# EAGLE design Arduino-DUE-V03A (EAGLE 8.5.2)
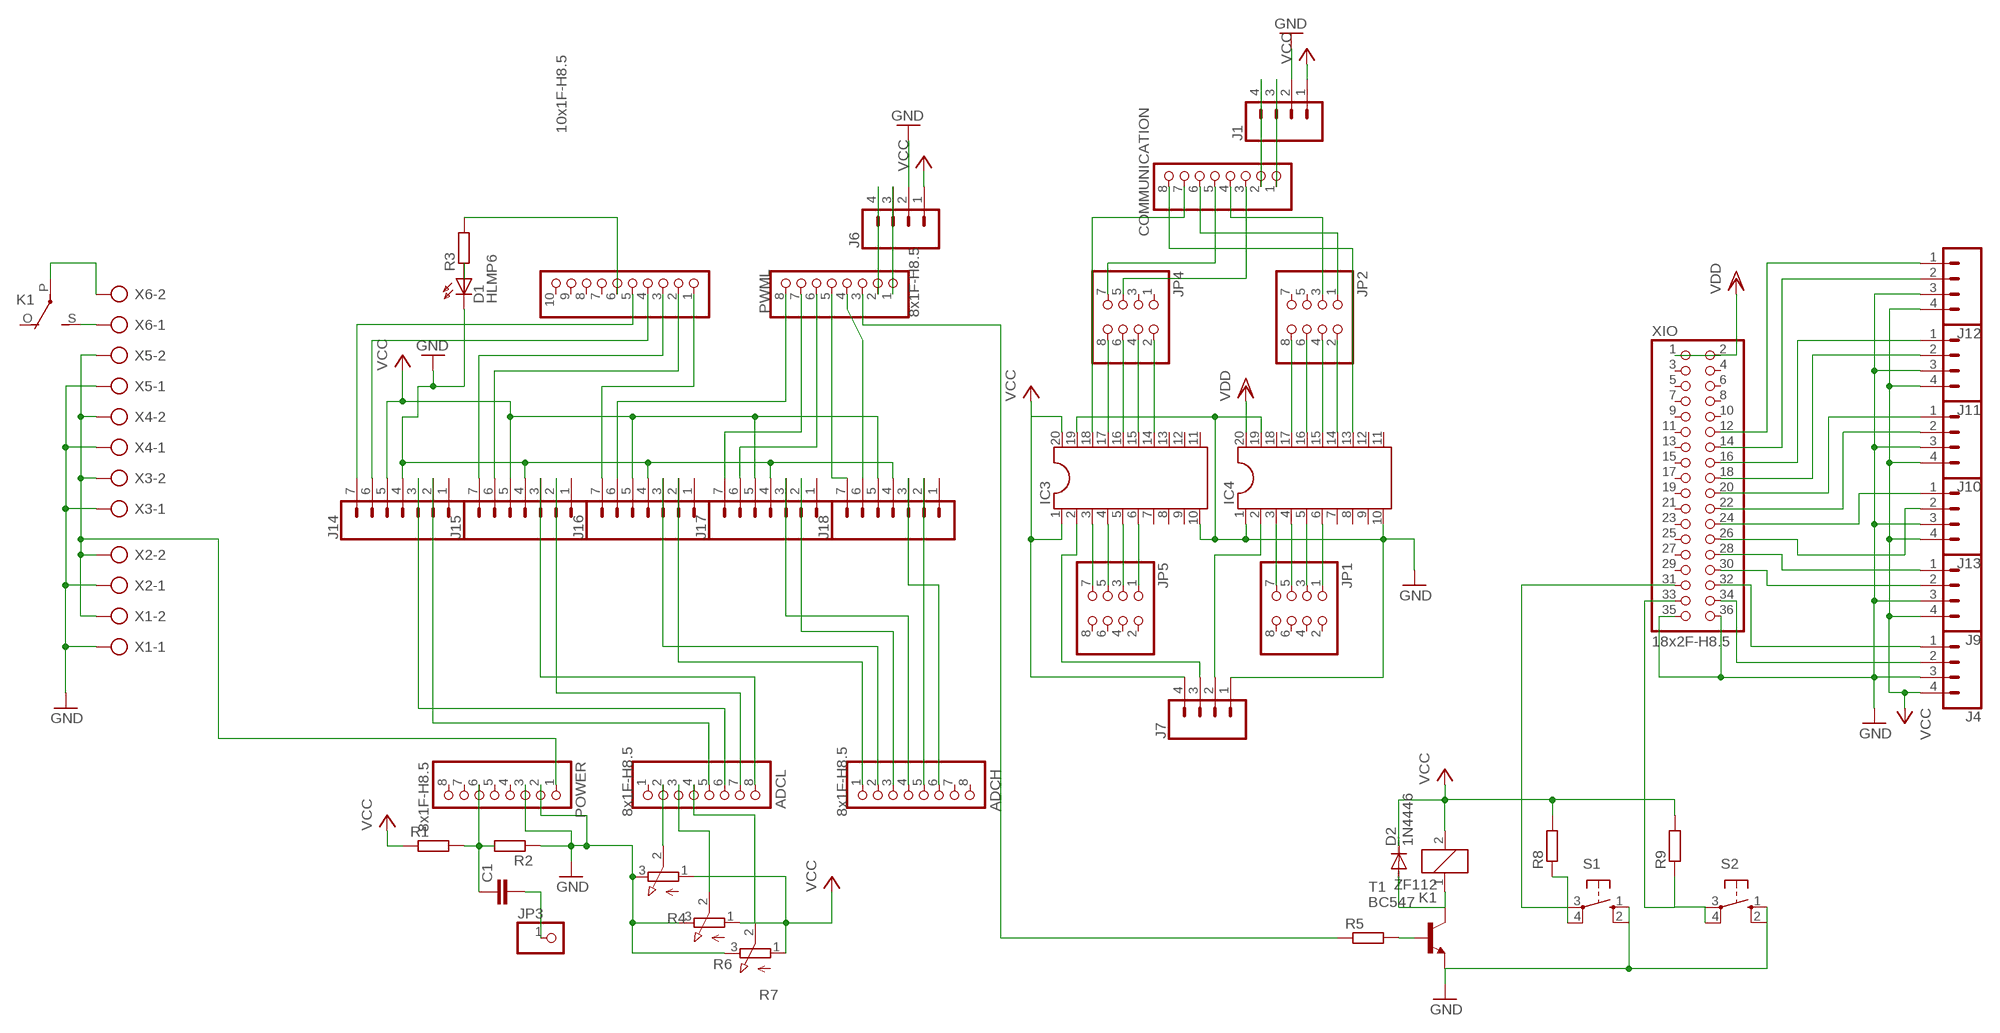
[diagram p0: schematic, sheet 1]

## Parts
ADCH  8x1F-H8.5  PINHD-1X8  [1X08]
ADCL  8x1F-H8.5  PINHD-1X8  [1X08]
C1  C-EU025-025X050  [C025-025X050]
COMMUNICATION  8x1F-H8.5  PINHD-1X8  [1X08]
D1  HLMP6  [HLMP6]
D2  1N4446  [DO35-10]
IC3  DIL20S  [SOCKET-20]
IC4  DIL20S  [SOCKET-20]
J1  CONN_04LONGPADS  [1X04_LONGPADS]
J4  CONN_04LONGPADS  [1X04_LONGPADS]
J6  CONN_04LONGPADS  [1X04_LONGPADS]
J7  CONN_04LONGPADS  [1X04_LONGPADS]
J9  CONN_04LONGPADS  [1X04_LONGPADS]
J10  CONN_04LONGPADS  [1X04_LONGPADS]
J11  CONN_04LONGPADS  [1X04_LONGPADS]
J12  CONN_04LONGPADS  [1X04_LONGPADS]
J13  CONN_04LONGPADS  [1X04_LONGPADS]
J14  CONN_07LONGPADS  [1X07_LONGPADS]
J15  CONN_07LONGPADS  [1X07_LONGPADS]
J16  CONN_07LONGPADS  [1X07_LONGPADS]
J17  CONN_07LONGPADS  [1X07_LONGPADS]
J18  CONN_07LONGPADS  [1X07_LONGPADS]
JP1  PINHD-2X4  [2X04]
JP2  PINHD-2X4  [2X04]
JP3  PINHD-1X1  [1X01]
JP4  PINHD-2X4  [2X04]
JP5  PINHD-2X4  [2X04]
K1  ZF112  [ZF112]
POWER  8x1F-H8.5  PINHD-1X8  [1X08]
PWMH  10x1F-H8.5  PINHD-1X10  [1X10]
PWML  8x1F-H8.5  PINHD-1X8  [1X08]
R1  R-EU_0204/7  [0204/7]
R2  R-EU_0204/7  [0204/7]
R3  R-EU_0204/7  [0204/7]
R4  3RP/1610N  [3RP/1610N]
R5  R-EU_0204/7  [0204/7]
R6  3RP/1610N  [3RP/1610N]
R7  3RP/1610N  [3RP/1610N]
R8  R-EU_0204/7  [0204/7]
R9  R-EU_0204/7  [0204/7]
S1  10-XX  [B3F-10XX]
S2  10-XX  [B3F-10XX]
T1  BC547  [TO92]
X1  AK500/2  [AK500/2]
X2  AK500/2  [AK500/2]
X3  AK500/2  [AK500/2]
X4  AK500/2  [AK500/2]
X5  AK500/2  [AK500/2]
X6  AK500/2  [AK500/2]
XIO  18x2F-H8.5  PINHD-2X18  [2X18]

## Nets
GND: D1.K IC3.10 IC3.19 IC4.1 IC4.10 IC4.19 J1.2 J4.3 J6.2 J7.1 J9.3 J10.3 J11.3 J12.3 J13.1 J13.3 J14.4 J15.4 J16.4 J17.4 J18.4 POWER.2 POWER.3 R2.1 R4.3(E) R6.3(E) R7.3(E) S1.1(S) S1.2(S1) S2.1(S) S2.2(S1) T1.1(E) X1.1 X2.1 X3.1 X4.1 X5.1 XIO.24 XIO.35 XIO.36
N$1: J14.6 PWMH.4
N$3: K1.S(2:S) X6.1
N$4: K1.P(2:P) X6.2
N$6: J4.2 XIO.34
N$7: J15.6 PWMH.2
N$8: J4.1 XIO.32
N$9: COMMUNICATION.3 JP4.5
N$10: J9.2 XIO.30
N$11: J13.2 XIO.26
N$12: POWER.1 X1.2 X2.2 X3.2 X4.2 X5.2
N$13: J12.2 XIO.14
N$14: J10.2 XIO.22
N$15: J10.1 XIO.20
N$16: J11.2 XIO.18
N$17: J11.1 XIO.16
N$18: J12.1 XIO.12
N$19: R5.2 T1.2(B)
N$20: C1.2 JP3.1
N$21: J16.7 PWMH.1
N$22: J14.7 PWMH.5
N$23: J15.7 PWMH.3
N$24: J17.7 PWML.7
N$25: J16.6 PWML.8
N$26: J17.6 PWML.6
N$27: J18.6 PWML.4
N$28: ADCL.6 J14.3
N$29: ADCL.5 J14.2
N$30: ADCH.6 J18.3
N$31: ADCH.5 J18.2
N$32: ADCH.4 J17.3
N$33: D1.A R3.1
N$34: ADCH.3 J17.2
N$35: ADCH.2 J16.3
N$36: ADCH.1 J16.2
N$37: ADCL.8 J15.3
N$38: PWMH.6 R3.2
N$39: C1.1 POWER.6 R1.2 R2.2
N$40: ADCL.7 J15.2
N$41: J18.7 PWML.5
N$42: COMMUNICATION.1 J1.3
N$43: IC4.17 JP2.8
N$44: IC4.16 JP2.6
N$45: IC4.15 JP2.4
N$46: IC4.14 JP2.2
N$47: IC3.6 JP5.1
N$48: IC3.5 JP5.3
N$49: IC3.4 JP5.5
N$50: IC3.3 JP5.7
N$51: IC3.17 JP4.8
N$52: IC3.16 JP4.6
N$53: IC3.15 JP4.4
N$54: IC3.14 JP4.2
N$55: IC4.3 JP1.7
N$56: IC4.4 JP1.5
N$57: IC4.5 JP1.3
N$58: IC4.6 JP1.1
N$59: COMMUNICATION.7 IC3.18
N$60: J6.4 PWML.2
N$61: J6.3 PWML.1
N$62: COMMUNICATION.6 JP2.1
N$63: COMMUNICATION.2 J1.4
N$64: COMMUNICATION.4 JP2.3
N$65: COMMUNICATION.5 JP4.7
N$66: IC3.2 J7.3
N$67: IC4.2 J7.2
N$68: D2.A K1.1 T1.3(C)
N$69: R8.1 S1.3(P) S1.4(P1) XIO.31
N$70: ADCL.2 R4.2(S)
N$71: ADCL.4 R7.2(S)
N$72: ADCL.3 R6.2(S)
N$73: PWML.3 R5.1
N$74: R9.1 S2.3(P) S2.4(P1) XIO.33
N$75: J9.1 XIO.28
N$76: COMMUNICATION.8 IC4.13
VCC: D2.C IC3.1 IC3.20 J1.1 J4.4 J6.1 J7.4 J9.4 J10.4 J11.4 J12.4 J13.4 J14.5 J15.5 J16.5 J17.5 J18.5 K1.2 R1.1 R4.1(A) R6.1(A) R7.1(A) R8.2 R9.2
VDD: IC4.20 XIO.1 XIO.2
Unconnected: ADCH.7 ADCH.8 ADCL.1 IC3.7 IC3.8 IC3.9 IC3.11 IC3.12 IC3.13 IC4.7 IC4.8 IC4.9 IC4.11 IC4.12 IC4.18 J14.1 J15.1 J16.1 J17.1 J18.1 JP1.2 JP1.4 JP1.6 JP1.8 JP2.5 JP2.7 JP4.1 JP4.3 JP5.2 JP5.4 JP5.6 JP5.8 K1.O(2:O) POWER.4 POWER.5 POWER.7 POWER.8 PWMH.7 PWMH.8 PWMH.9 PWMH.10 XIO.3 XIO.4 XIO.5 XIO.6 XIO.7 XIO.8 XIO.9 XIO.10 XIO.11 XIO.13 XIO.15 XIO.17 XIO.19 XIO.21 XIO.23 XIO.25 XIO.27 XIO.29

## Library data of the parts
ADCH ADCL COMMUNICATION POWER PWML = SmartPrj:PINHD-1X8: PIN HEADER
C1 = rcl:C-EU: CAPACITOR, European symbol
D1 = display-hp:HLMP6: LED 2mm horizontal; MF: AGILENT TECHNOLOGIES; MPN: HLMP-6500; OC_FARNELL: 1652490; OC_NEWARK: 40K0088
D2 = diode:1N4446: DIODE high speed (Philips)
IC3 IC4 = ic-package:DIL20: Dual In Line / Socket
J1 J4 J6 J7 J9-J13 = SparkFun-Connectors:CONN_04: Multi connection point. Often used as Generic Header-pin footprint for 0.1 inch spaced/style header connections On any of the 0.1 inch spaced packages, you can populate with these: Break Away Headers - Straight <https://www.sparkfun.com/products/116> (PRT-00116) Break Away Male Headers - Right Angle <https://www.sparkfun.com/products/553> (PRT-00553) Female Headers <https://www.sparkfun.com/products/115> (PRT-00115) Break Away Headers - Machine Pin <https://www.sparkfun.com/products/117> (PRT-00117) Break Away Female Headers - Swiss Machine Pin <https://www.sparkfun.com/products/743> (PRT-00743) For SCREWTERMINALS and SPRING TERMINALS visit here: Screw Terimnals on SparkFun.com <https://www.sparkfun.com/search/results?term=Screw+Terminals> (5mm/3.5mm/2.54mm spacing) This device is also useful as a general connection point to wire up your design to another part of your project. Our various solder wires solder well into these plated through hole pads. Hook-Up Wire - Assortment (Stranded, 22 AWG) <https://www.sparkfun.com/products/11375> (PRT-11375) Hook-Up Wire - Assortment (Solid Core, 22 AWG) <https://www.sparkfun.com/products/11367> (PRT-11367) View the entire wire category on our website here <https://www.sparkfun.com/categories/141> Special notes: Molex polarized connector foot print use with SKU : PRT-08231 with associated crimp pins and housings. 1MM SMD Version SKU: PRT-10208; PROD_ID: CONN-09696
J14-J18 = SparkFun-Connectors:CONN_07: Multi connection point. Often used as Generic Header-pin footprint for 0.1 inch spaced/style header connections On any of the 0.1 inch spaced packages, you can populate with these: Break Away Headers - Straight <https://www.sparkfun.com/products/116> (PRT-00116) Break Away Male Headers - Right Angle <https://www.sparkfun.com/products/553> (PRT-00553) Female Headers <https://www.sparkfun.com/products/115> (PRT-00115) Break Away Headers - Machine Pin <https://www.sparkfun.com/products/117> (PRT-00117) Break Away Female Headers - Swiss Machine Pin <https://www.sparkfun.com/products/743> (PRT-00743) For SCREWTERMINALS and SPRING TERMINALS visit here: Screw Terimnals on SparkFun.com <https://www.sparkfun.com/search/results?term=Screw+Terminals> (5mm/3.5mm/2.54mm spacing) This device is also useful as a general connection point to wire up your design to another part of your project. Our various solder wires solder well into these plated through hole pads. Hook-Up Wire - Assortment (Stranded, 22 AWG) <https://www.sparkfun.com/products/11375> (PRT-11375) Hook-Up Wire - Assortment (Solid Core, 22 AWG) <https://www.sparkfun.com/products/11367> (PRT-11367) View the entire wire category on our website here <https://www.sparkfun.com/categories/141> Special notes: Molex polarized connector foot print use with SKU : PRT-08231 with associated crimp pins and housings. 1MM SMD Version SKU: PRT-10208 NOTES ON THE VARIANTS LOCK and LOCK_LONGPADS... This footprint was designed to help hold the alignment of a through-hole component (i.e. 6-pin header) while soldering it into place. You may notice that each hole has been shifted either up or down by 0.005 of an inch from it's more standard position (which is a perfectly straight line). This slight alteration caused the pins (the squares in the middle) to touch the edges of the holes. Because they are alternating, it causes a "brace" to hold the component in place. 0.005 has proven to be the perfect amount of "off-center" position when using our standard breakaway headers. Although looks a little odd when you look at the bare footprint, once you have a header in there, the alteration is very hard to notice. Also,if you push a header all the way into place, it is covered up entirely on the bottom side.
JP1 JP2 JP4 JP5 = pinhead:PINHD-2X4: PIN HEADER
JP3 = pinhead:PINHD-1X1: PIN HEADER
K1 = relay:ZF112: RELAY 1 x switch; OC_FARNELL: unknown; OC_NEWARK: unknown
PWMH = SmartPrj:PINHD-1X10: PIN HEADER
R1-R3 R5 R8 R9 = rcl:R-EU_: RESISTOR, European symbol
R4 R6 R7 = pot:3RP/1610N: 16mm Potentiometer one level Source: http://www.alphapotentiometers.net/html/16mm_pot_2.html
S1 S2 = switch-omron:10-XX: OMRON SWITCH; MPN: B3F-1000; OC_FARNELL: 176432; OC_NEWARK: 36M3542
T1 = transistor:BC547: NPN TRANSISTOR
X1-X6 = con-ptr500:AK500/2: CONNECTOR; OC_FARNELL: unknown; OC_NEWARK: unknown
XIO = SmartPrj:PINHD-2X18: PIN HEADER

## Net classes
0 default: width 0.203 mm, drill 0.406 mm, clearance 0.203 mm
1 USB: width 0.203 mm, drill 0.406 mm, clearance 0.203 mm
2 gnd: width 0.203 mm, drill 0.406 mm, clearance 0.203 mm
3 usbvcc: width 0.203 mm, drill 0.406 mm, clearance 0.203 mm
4 USBpair: width 0.254 mm, drill 0.406 mm, clearance 0.61 mm

## Board
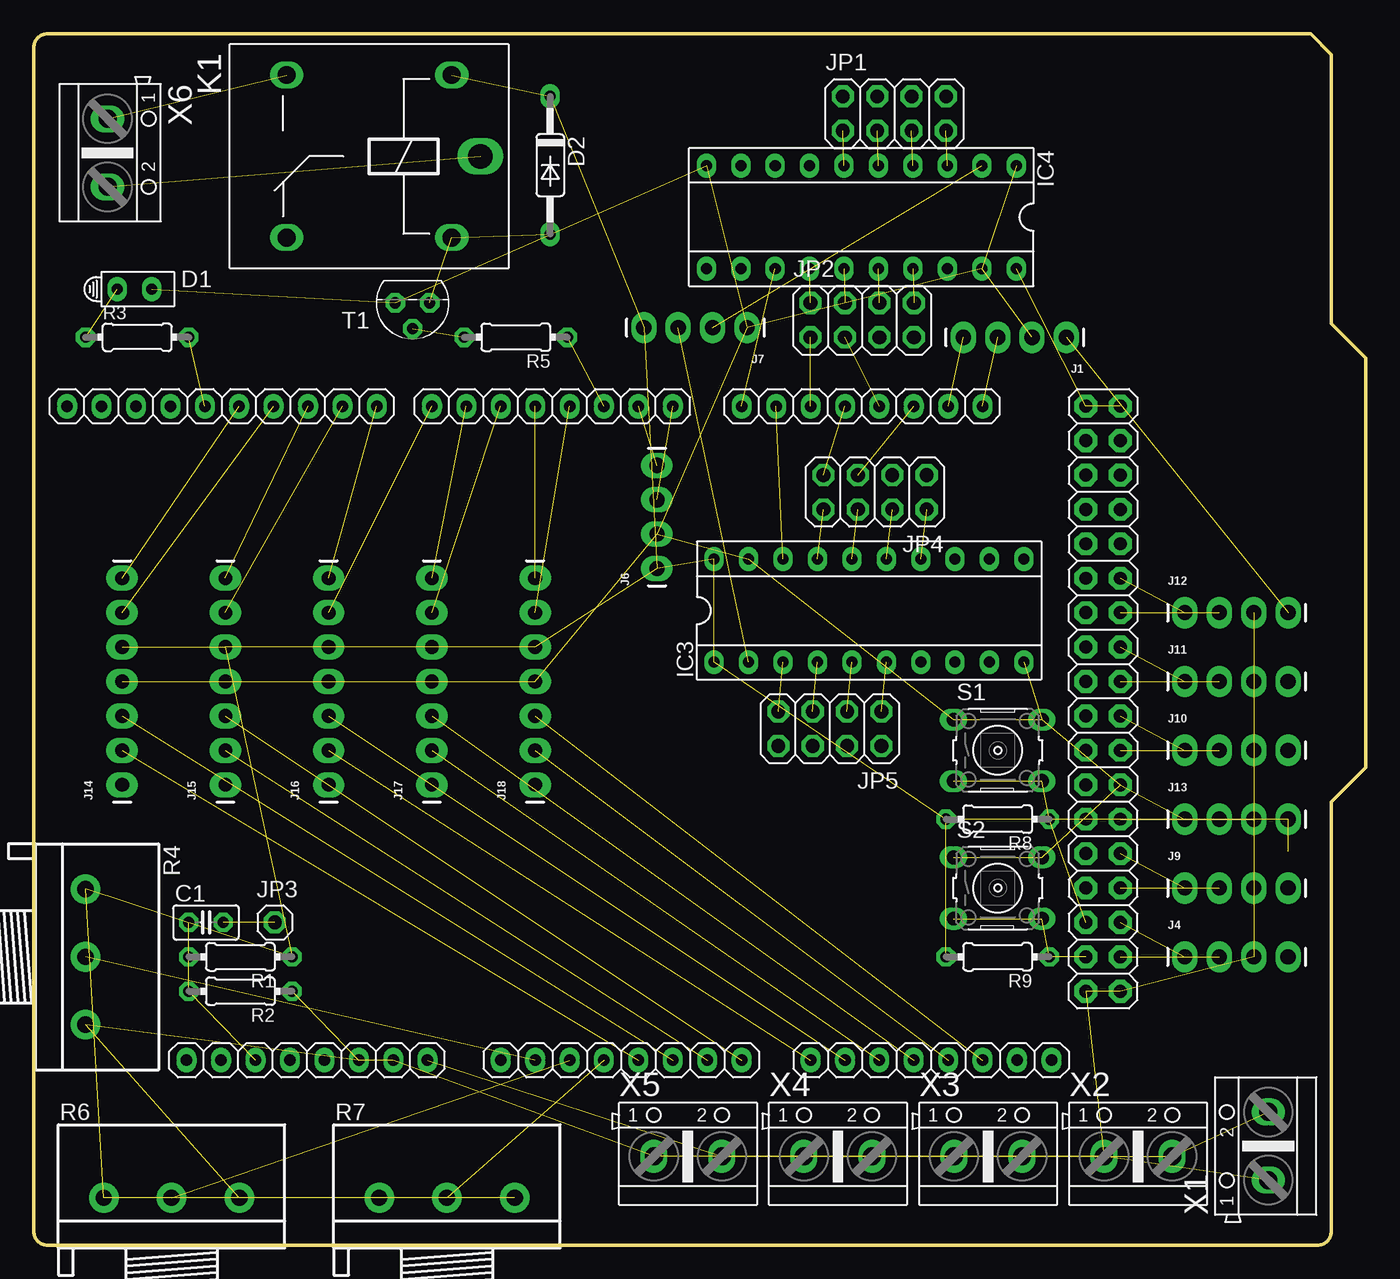
[diagram p1: board, top side]
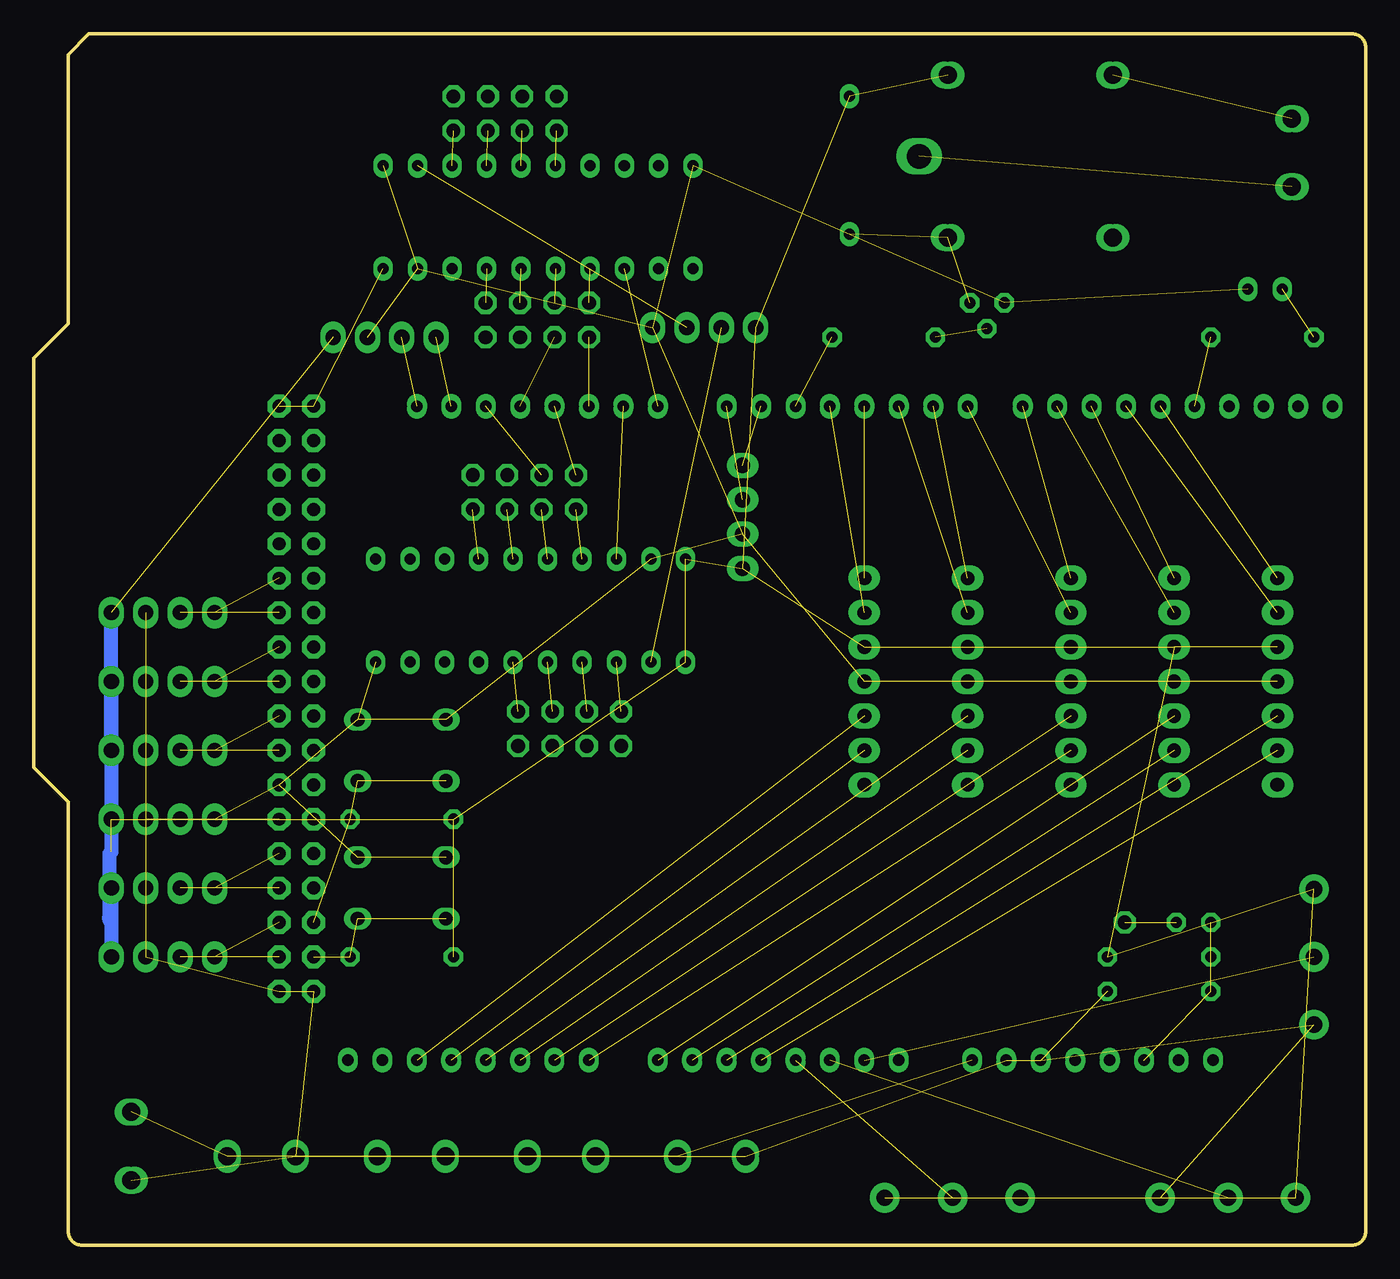
[diagram p2: board, bottom side, seen from below]

Size 98.27 x 89.38 mm. Coordinates in mm from the lower left corner, seen from the top.
Outline: 94.21,89.38 95.73,87.86 95.73,68.01 98.27,65.47 98.27,35.24 95.73,32.7 95.73,1 arc-90 94.73,0 1,0 arc-90 0,1 0,88.38 arc-90 1,89.38 94.21,89.38
Copper layers (1*16): Top 0.035mm / dielectric 1.6mm / Bottom 0.035mm
Design rules "default *": minimum track width 8mil, minimum drill 16mil, track to track 8mil, track to pad 8mil, pad to pad 8mil, via to via 8mil, smd to smd 6mil, copper to edge 20mil, drill to drill 12mil, minimum pad ring 12mil, minimum via ring 8mil, stop-mask expansion 2mil, vias tented up to drill 25mil, thermal gap 8mil

### Footprints (pad centres in the part's own frame; a part is rotated, then mirrored left to right if it is on the bottom)
1X08 = drill 0.85 pad 1.422 long: 1 -8.89,0; 2 -6.35,0; 3 -3.81,0; 4 -1.27,0; 5 1.27,0; 6 3.81,0; 7 6.35,0; 8 8.89,0
C025-025X050 = drill 0.813 octagon: 1 -1.27,0; 2 1.27,0
HLMP6 = drill 0.813 long: A -1.27,0; K 1.27,0
DO35-10 = drill 0.813 long: A 5.08,0; C -5.08,0
SOCKET-20 = drill 0.813 long: 1 -11.43,-3.81; 2 -8.89,-3.81; 3 -6.35,-3.81; 4 -3.81,-3.81; 5 -1.27,-3.81; 6 1.27,-3.81; 7 3.81,-3.81; 8 6.35,-3.81; 9 8.89,-3.81; 10 11.43,-3.81; 11 11.43,3.81; 12 8.89,3.81; 13 6.35,3.81; 14 3.81,3.81; 15 1.27,3.81; 16 -1.27,3.81; 17 -3.81,3.81; 18 -6.35,3.81; 19 -8.89,3.81; 20 -11.43,3.81
1X04_LONGPADS = drill 1.118 pad 1.88 long: 1 0,0; 2 2.54,0; 3 5.08,0; 4 7.62,0
1X07_LONGPADS = drill 1.016 pad 1.88 long: 1 0,0; 2 2.54,0; 3 5.08,0; 4 7.62,0; 5 10.16,0; 6 12.7,0; 7 15.24,0
2X04 = drill 1.016 octagon: 1 -3.81,-1.27; 2 -3.81,1.27; 3 -1.27,-1.27; 4 -1.27,1.27; 5 1.27,-1.27; 6 1.27,1.27; 7 3.81,-1.27; 8 3.81,1.27
1X01 = drill 1.016 octagon: 1 0,0
ZF112 = drill 1.321 long: 1 -6.096,5.994; 2 -6.096,-5.994; O 6.096,5.994; S 6.096,-5.994 | drill 1.803 long: P -8.204,0
1X10 = drill 0.85 pad 1.422 long: 1 -11.43,0; 2 -8.89,0; 3 -6.35,0; 4 -3.81,0; 5 -1.27,0; 6 1.27,0; 7 3.81,0; 8 6.35,0; 9 8.89,0; 10 11.43,0
0204/7 = drill 0.813 octagon: 1 -3.81,0; 2 3.81,0
3RP/1610N = drill 1.2 pad 2.184: 1 -5,0; 2 0,0; 3 5,0
B3F-10XX = drill 1.016 long: 1 -3.251,2.261; 2 3.251,2.261; 3 -3.251,-2.261; 4 3.251,-2.261
TO92 = drill 0.813 octagon: 1 1.27,0; 2 0,1.905; 3 -1.27,0
AK500/2 = drill 1.321 long: 1 -2.515,0; 2 2.515,0
2X18 = drill 0.95 pad 1.676 octagon: 1 -21.59,-1.27; 2 -21.59,1.27; 3 -19.05,-1.27; 4 -19.05,1.27; 5 -16.51,-1.27; 6 -16.51,1.27; 7 -13.97,-1.27; 8 -13.97,1.27; 9 -11.43,-1.27; 10 -11.43,1.27; 11 -8.89,-1.27; 12 -8.89,1.27; 13 -6.35,-1.27; 14 -6.35,1.27; 15 -3.81,-1.27; 16 -3.81,1.27; 17 -1.27,-1.27; 18 -1.27,1.27; 19 1.27,-1.27; 20 1.27,1.27; 21 3.81,-1.27; 22 3.81,1.27; 23 6.35,-1.27; 24 6.35,1.27; 25 8.89,-1.27; 26 8.89,1.27; 27 11.43,-1.27; 28 11.43,1.27; 29 13.97,-1.27; 30 13.97,1.27; 31 16.51,-1.27; 32 16.51,1.27; 33 19.05,-1.27; 34 19.05,1.27; 35 21.59,-1.27; 36 21.59,1.27

### Placement (x,y rotation side)
ADCH  66.2,13.65 0 top
ADCL  43.34,13.65 0 top
C1  12.7,23.81 0 top
COMMUNICATION  61.12,61.91 180 top
D1  7.42,70.55 0 top
D2  38.1,79.69 270 top
IC3  61.63,46.82 0 top
IC4  61.05,75.85 180 top
J1  76.2,66.99 180 top
J4  84.93,21.27 0 top
J6  45.97,49.92 90 top
J7  52.63,67.7 180 top
J9  84.93,26.35 0 top
J10  84.93,36.51 0 top
J11  84.93,41.59 0 top
J12  84.93,46.67 0 top
J13  84.93,31.43 0 top
J14  6.51,33.97 90 top
J15  14.13,33.97 90 top
J16  21.75,33.97 90 top
J17  29.37,33.97 90 top
J18  36.99,33.97 90 top
JP1  63.5,83.5 0 top
JP2  61.12,68.26 0 top
JP3  17.78,23.81 0 top
JP4  62.07,55.56 180 top
JP5  58.74,38.1 180 top
K1  24.74,80.35 180 top
POWER  20.16,13.65 180 top
PWMH  13.88,61.91 180 top
PWML  38.26,61.91 180 top
R1  15.24,21.27 180 top
R2  15.24,18.73 180 top
R3  7.62,66.99 0 top
R4  3.81,21.27 270 top
R5  35.56,66.99 180 top
R6  10.16,3.49 0 top
R7  30.48,3.49 0 top
R8  71.12,31.43 180 top
R9  71.12,21.27 180 top
S1  71.12,36.51 0 top
S2  71.12,26.35 0 top
T1  27.94,69.53 180 top
X1  91.08,7.31 90 top
X2  81.48,6.55 0 top
X3  70.41,6.55 0 top
X4  59.33,6.55 0 top
X5  48.26,6.55 0 top
X6  5.44,80.6 270 top
XIO  78.9,40.32 270 top

### Tracks (layer width: path | path; a pad name or v marks a point on that pad's centre or on a via)
GND  (39 unrouted)
N$1  (1 unrouted)
N$3  (1 unrouted)
N$4  (1 unrouted)
N$6  (1 unrouted)
N$7  (1 unrouted)
N$8  (1 unrouted)
N$9  (1 unrouted)
N$10  (1 unrouted)
N$11  (1 unrouted)
N$12  (5 unrouted)
N$13  (1 unrouted)
N$14  (1 unrouted)
N$15  (1 unrouted)
N$16  (1 unrouted)
N$17  (1 unrouted)
N$18  (1 unrouted)
N$19  (1 unrouted)
N$20  (1 unrouted)
N$21  (1 unrouted)
N$22  (1 unrouted)
N$23  (1 unrouted)
N$24  (1 unrouted)
N$25  (1 unrouted)
N$26  (1 unrouted)
N$27  (1 unrouted)
N$28  (1 unrouted)
N$29  (1 unrouted)
N$30  (1 unrouted)
N$31  (1 unrouted)
N$32  (1 unrouted)
N$33  (1 unrouted)
N$34  (1 unrouted)
N$35  (1 unrouted)
N$36  (1 unrouted)
N$37  (1 unrouted)
N$38  (1 unrouted)
N$39  (3 unrouted)
N$40  (1 unrouted)
N$41  (1 unrouted)
N$42  (1 unrouted)
N$43  (1 unrouted)
N$44  (1 unrouted)
N$45  (1 unrouted)
N$46  (1 unrouted)
N$47  (1 unrouted)
N$48  (1 unrouted)
N$49  (1 unrouted)
N$50  (1 unrouted)
N$51  (1 unrouted)
N$52  (1 unrouted)
N$53  (1 unrouted)
N$54  (1 unrouted)
N$55  (1 unrouted)
N$56  (1 unrouted)
N$57  (1 unrouted)
N$58  (1 unrouted)
N$59  (1 unrouted)
N$60  (1 unrouted)
N$61  (1 unrouted)
N$62  (1 unrouted)
N$63  (1 unrouted)
N$64  (1 unrouted)
N$65  (1 unrouted)
N$66  (1 unrouted)
N$67  (1 unrouted)
N$68  (2 unrouted)
N$69  (3 unrouted)
N$70  (1 unrouted)
N$71  (1 unrouted)
N$72  (1 unrouted)
N$73  (1 unrouted)
N$74  (3 unrouted)
N$75  (1 unrouted)
N$76  (1 unrouted)
VCC  (19 unrouted)
  Bottom 1.016: J11.4 J10.4 | J10.4 J12.4 | J10.4 92.55,29.05 92.71,28.89 92.71,23.97 J9.4 J4.4
VDD  (2 unrouted)